# EAGLE design UH_007 (EAGLE 7.3.0)
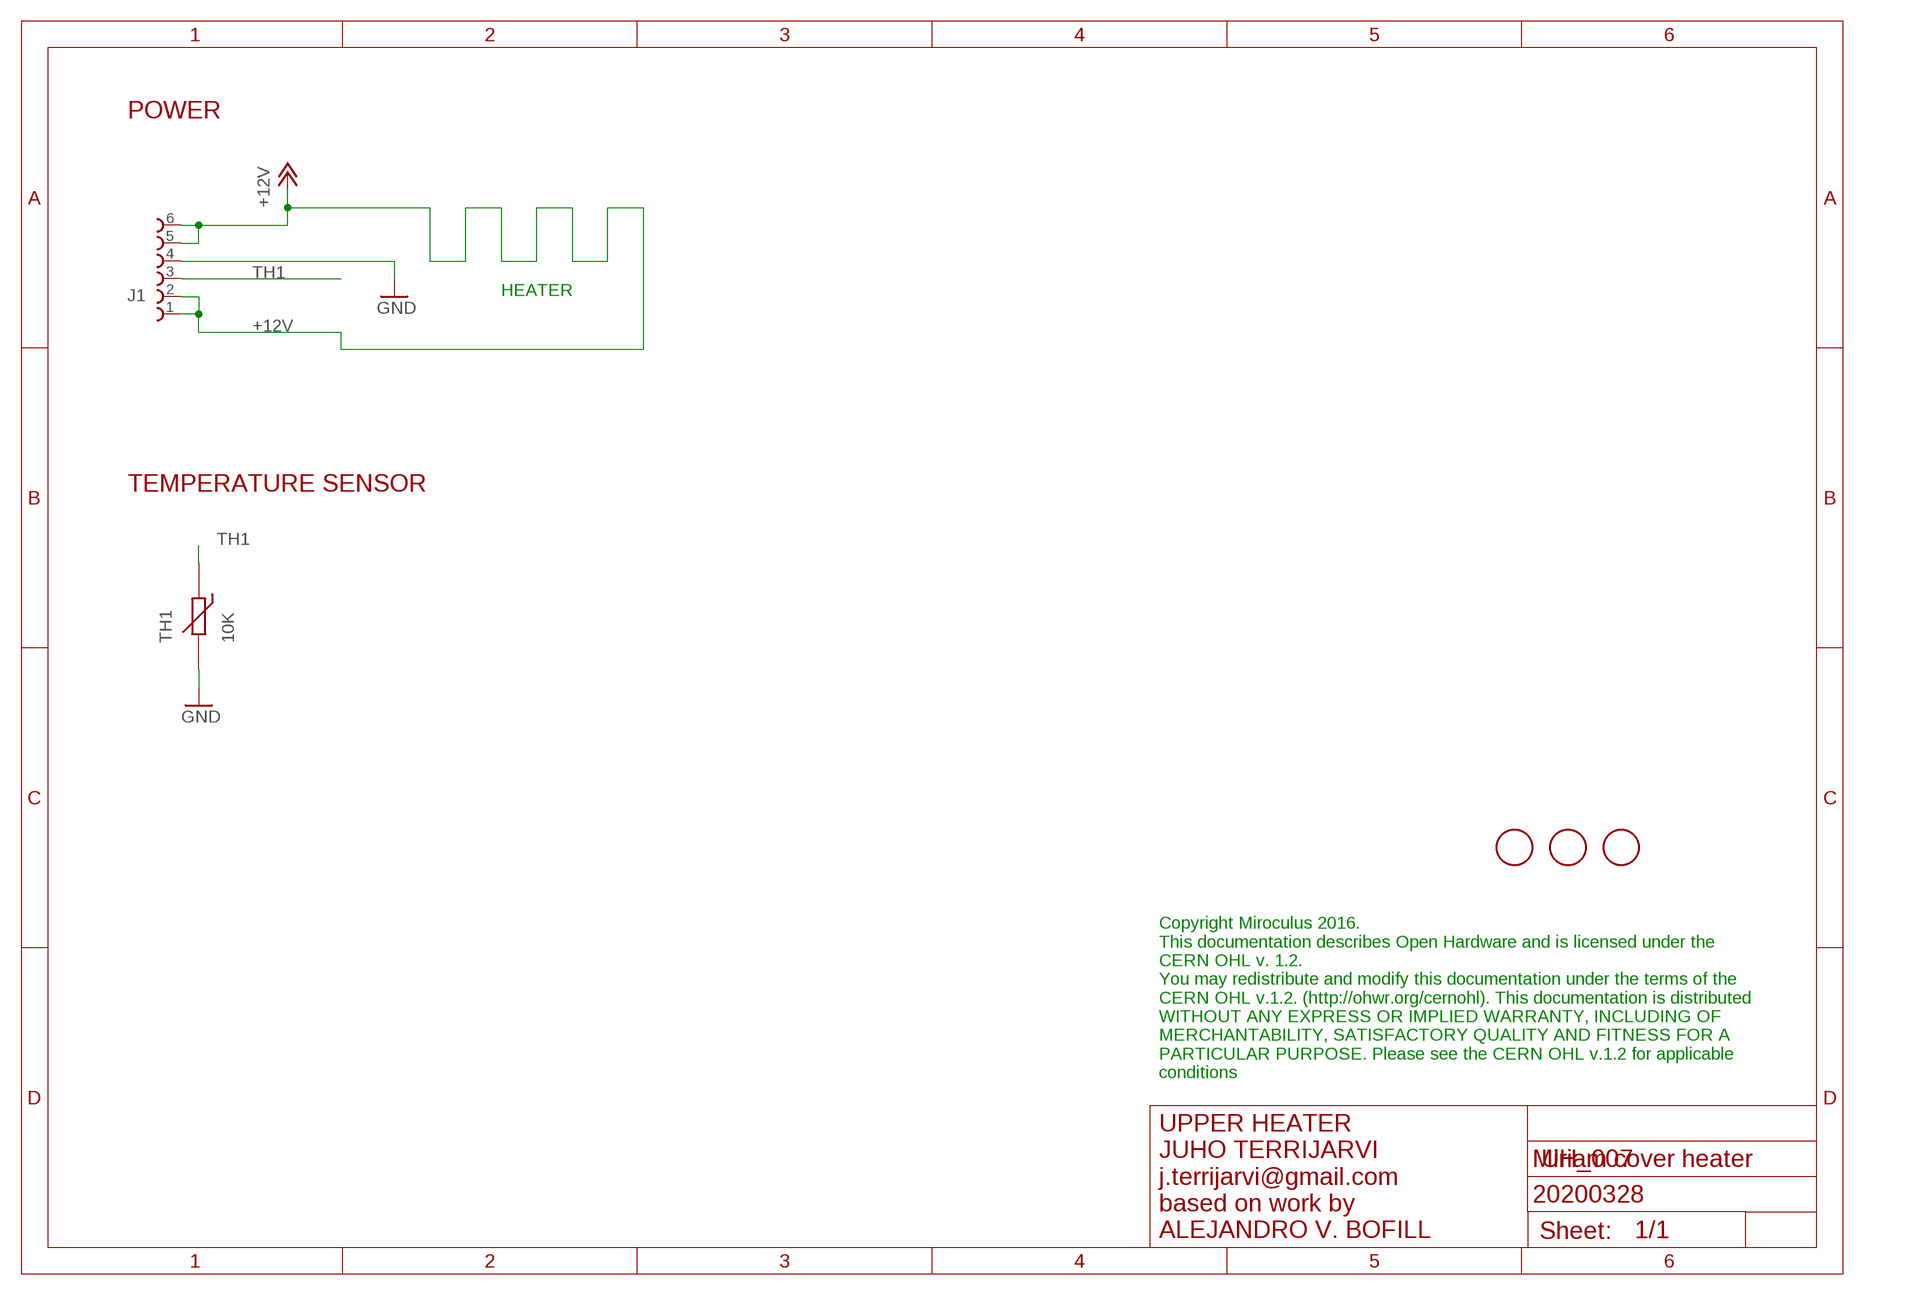
[diagram p0: schematic, sheet 1]

## Parts
FD1  FIDUCIALMOUNT  [FIDUCIA-MOUNT]
FD2  FIDUCIALMOUNT  [FIDUCIA-MOUNT]
FD3  FIDUCIALMOUNT  [FIDUCIA-MOUNT]
J1  68710614522  [68710614522]
TH1  10K  THERMISTOR_SMD_0603  [THERMISTOR_SMD_0603]

## Nets
+12V [power12]: J1.1 J1.2 J1.5 J1.6
GND: J1.4 TH1.2
TH1: J1.3 TH1.1

## Notes on the sheet
- POWER
- HEATER
- TEMPERATURE SENSOR
- Copyright Miroculus 2016.
  This documentation describes Open Hardware and is licensed under the
  CERN OHL v. 1.2.
  You may redistribute and modify this documentation under the terms of the
  CERN OHL v.1.2. (http://ohwr.org/cernohl). This documentation is distributed
  WITHOUT ANY EXPRESS OR IMPLIED WARRANTY, INCLUDING OF
  MERCHANTABILITY, SATISFACTORY QUALITY AND FITNESS FOR A
  PARTICULAR PURPOSE. Please see the CERN OHL v.1.2 for applicable
  conditions
- UPPER HEATER
  JUHO TERRIJARVI
  j.terrijarvi@gmail.com
  based on work by
  ALEJANDRO V. BOFILL
- Miriam cover heater
- 20200328

## Library data of the parts
FD1-FD3 = SmartPrj:FIDUCIALMOUNT
J1 = Eagle_FPC_CONNECTOR_AND_FFC_CAB (rev18c):68710614522: WE-FPC 0.5mm SMT ZIF Horizontal Bottom Contact, 6 Pins=>Code : Con_FPC_ZIF_0.50_68710614522 <http://katalog.we-online.de/media/images/eican/Con_FPC_ZIF_0.50_6871xx14522_pf2.jpg> Details see: http://katalog.we-online.de/en/em/687_1xx_145_22 Created 2014-07-09, Karrer Zheng 2014 (C) Würth Elektronik
TH1 = Miroculus:THERMISTOR_SMD_0603

## Net classes
0 default: width 0.254 mm, drill 0.406 mm, clearance 0.178 mm
1 power: width 0.406 mm, drill 0.813 mm, clearance 0.406 mm
2 gnd: width 0.254 mm, drill 0.406 mm, clearance 0.178 mm
3 power usb: width 0.305 mm, drill 0.406 mm, clearance 0.254 mm
4 power12: width 1.778 mm, drill 0.889 mm, clearance 0.406 mm

## Board
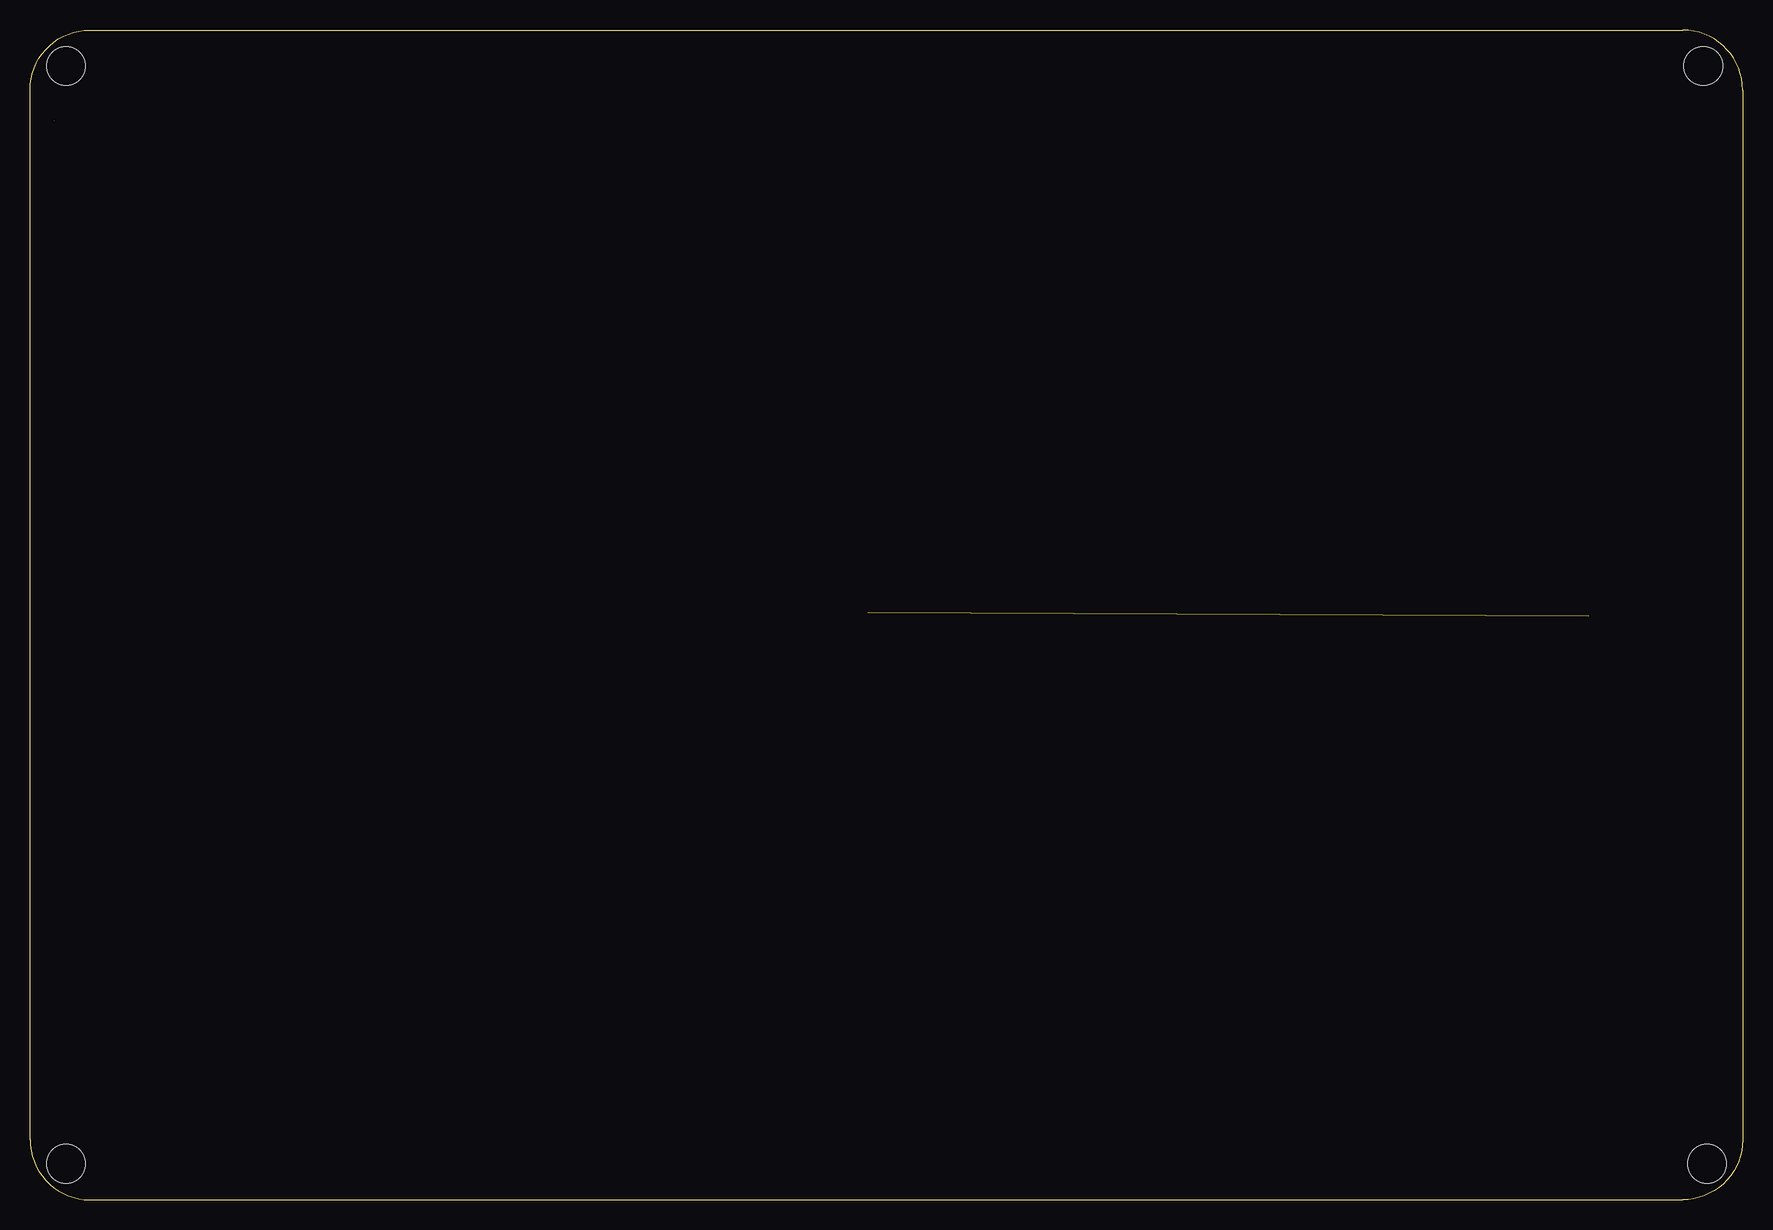
[diagram p1: board, top side]
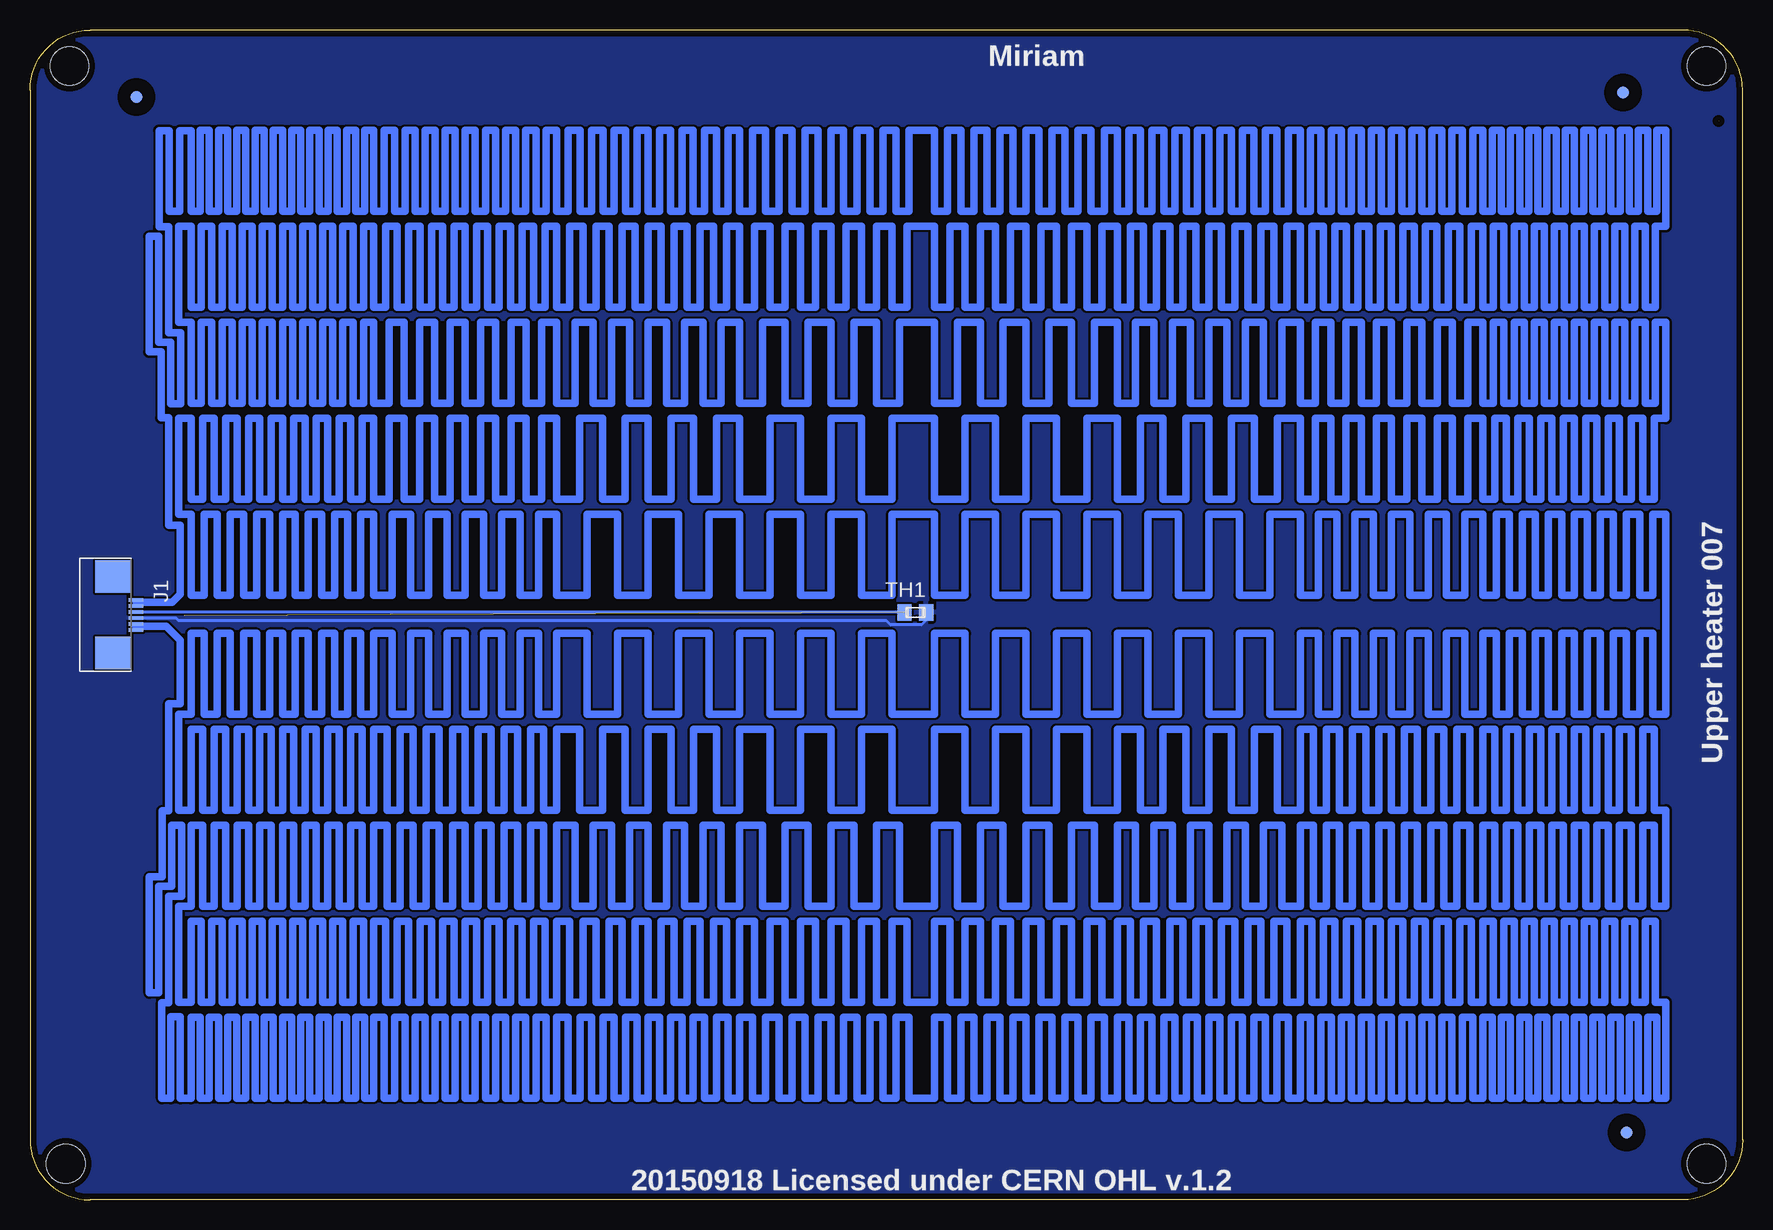
[diagram p2: board, bottom side, seen from below]

Size 142.76 x 97.48 mm. Coordinates in mm from the lower left corner, seen from the top.
Outline: 2.01,89.92 arc0 2.01,89.92
Outline: 0,5 arc90 5,0 137.76,0 arc90 142.76,5 142.76,92.48 arc90 137.76,97.48 5,97.48 arc90 0,92.48 0,5
Copper layers (1*16): Top 0.0178mm / dielectric 59mil / Bottom 0.0178mm
Design rules "SSC-EAGLE-2Lyr_v1.0.0.3": minimum track width 6mil, minimum drill 14mil, track to track 6mil, track to pad 6mil, pad to pad 6mil, via to via 6mil, smd to smd 6mil, copper to edge 20mil, drill to drill 16mil, minimum pad ring 8mil, minimum via ring 8mil, stop-mask expansion 3mil, vias tented up to drill 0mil, thermal gap 10mil
Holes 3.2 mm at 3,94.48 139.48,94.48 139.78,3 3,3

### Footprints (pad centres in the part's own frame; a part is rotated, then mirrored left to right if it is on the bottom)
FIDUCIA-MOUNT = smd 1.016 x 1.016: P$1 0,0
68710614522 = smd 0.3 x 1.2: 1 -1.25,1.9; 2 -0.75,1.9; 3 -0.25,1.9; 4 0.25,1.9; 5 0.75,1.9; 6 1.25,1.9 | smd 2.7 x 3: Z1 -3.18,0; Z2 3.18,0
THERMISTOR_SMD_0603 = smd 1.181 x 1.378: 1 -0.9,0; 2 0.9,0

### Placement (x,y rotation side)
FD1  9.67,5.62 0 bottom
FD2  9.96,92.29 0 bottom
FD3  133.89,91.91 0 bottom
J1  135.81,48.74 270 bottom
TH1  68.96,48.95 0 bottom

### Tracks (layer width: path | path; a pad name or v marks a point on that pad's centre or on a via)
+12V
  Bottom 0.254: J1.1 J1.2 133.91,49.78 | J1.6 J1.5 133.91,47.82 133.96,47.78
  Bottom 0.635: 133.91,49.78 130.91,49.78 130.25,50.44 130.25,56.21 131.19,56.21 131.19,65.15 131.83,65.15 131.83,70.66 132.84,70.66 132.84,80.29 132.03,80.29 132.03,71.45 131.04,71.45 131.04,66.32 130.2,66.32 130.2,72.26 131.19,72.26 131.19,81.1 132,81.1 132,89.1 131.17,89.1 131.17,82.37 130.28,82.37 130.28,89.1 129.34,89.1 129.34,82.39 128.57,82.39 128.57,89.12 127.81,89.12 127.81,82.39 127.05,82.39 127.05,89.12 126.29,89.12 126.29,82.39 125.53,82.39 125.53,89.12 124.77,89.12 124.77,82.39 124,82.39 124,89.12 123.24,89.12 123.24,82.39 122.48,82.39 122.48,89.12 121.72,89.12 121.72,82.39 120.95,82.39 120.95,89.12 120.19,89.12 120.19,82.39 119.43,82.39 119.43,89.12 118.67,89.12 118.67,82.39 117.91,82.39 117.91,89.12 117.14,89.12 117.14,82.39 116.38,82.39 116.38,89.12 115.62,89.12 115.62,82.39 114.86,82.39 114.86,89.12 114.1,89.12 114.1,82.39 113.23,82.39 113.23,89.12 112.37,89.12 112.37,82.39 111.51,82.39 111.51,89.12 110.67,89.12 110.67,82.39 109.83,82.39 109.83,89.12 108.99,89.12 108.99,82.39 108.15,82.39 108.15,89.12 107.31,89.12 107.31,82.39 106.48,82.39 106.48,89.12 105.64,89.12 105.64,82.39 104.8,82.39 104.8,89.12 103.96,89.12 103.96,82.39 103.12,82.39 103.12,89.12 102.29,89.12 102.29,82.39 101.45,82.39 101.45,89.12 100.58,89.12 100.58,82.39 99.72,82.39 99.72,89.12 98.86,89.12 98.86,82.39 97.89,82.39 97.89,89.12 96.93,89.12 96.93,82.39 95.96,82.39 95.96,89.12 95,89.12 95,82.39 94.06,82.39 94.06,89.12 93.12,89.12 93.12,82.39 92.18,82.39 92.18,89.12 91.24,89.12 91.24,82.39 90.3,82.39 90.3,89.12 89.36,89.12 89.36,82.39 88.42,82.39 88.42,89.12 87.48,89.12 87.48,82.39 86.51,82.39 86.51,89.12 85.55,89.12 85.55,82.39 84.58,82.39 84.58,89.12 83.62,89.12 83.62,82.39 82.53,82.39 82.53,89.12 81.43,89.12 81.43,82.39 80.34,82.39 80.34,89.12 79.25,89.12 79.25,82.39 78.16,82.39 78.16,89.12 77.06,89.12 77.06,82.39 76,82.39 76,89.12 74.93,89.12 74.93,82.39 73.84,82.39 73.84,89.12 72.75,89.12 72.75,82.39 71.65,82.39 71.65,89.12 70.56,89.12 70.56,82.39 69.47,82.39 69.47,89.12 67.36,89.12 67.36,82.39 66.27,82.39 66.27,89.12 65.18,89.12 65.18,82.39 64.08,82.39 64.08,89.12 62.99,89.12 62.99,82.39 61.9,82.39 61.9,89.12 60.81,89.12 60.81,82.39 59.74,82.39 59.74,89.12 58.67,89.12 58.67,82.39 57.58,82.39 57.58,89.12 56.49,89.12 56.49,82.39 55.4,82.39 55.4,89.12 54.3,89.12 54.3,82.39 53.21,82.39 53.21,89.12 52.12,89.12 52.12,82.39 51.16,82.39 51.16,89.12 50.19,89.12 50.19,82.39 49.23,82.39 49.23,89.12 48.26,89.12 48.26,82.39 47.32,82.39 47.32,89.12 46.38,89.12 46.38,82.39 45.44,82.39 45.44,89.12 44.5,89.12 44.5,82.39 43.56,82.39 43.56,89.12 42.62,89.12 42.62,82.39 41.68,82.39 41.68,89.12 40.74,89.12 40.74,82.39 39.78,82.39 39.78,89.12 38.81,89.12 38.81,82.39 37.85,82.39 37.85,89.12 36.88,89.12 36.88,82.39 36.02,82.39 36.02,89.12 35.15,89.12 35.15,82.39 34.29,82.39 34.29,89.12 33.45,89.12 33.45,82.39 32.61,82.39 32.61,89.12 31.77,89.12 31.77,82.39 30.94,82.39 30.94,89.12 30.1,89.12 30.1,82.39 29.26,82.39 29.26,89.12 28.42,89.12 28.42,82.39 27.58,82.39 27.58,89.12 26.75,89.12 26.75,82.39 25.91,82.39 25.91,89.12 25.07,89.12 25.07,82.39 24.23,82.39 24.23,89.12 23.37,89.12 23.37,82.39 22.5,82.39 22.5,89.12 21.64,89.12 21.64,82.39 20.88,82.39 20.88,89.12 20.12,89.12 20.12,82.39 19.36,82.39 19.36,89.12 18.59,89.12 18.59,82.39 17.83,82.39 17.83,89.12 17.07,89.12 17.07,82.39 16.31,82.39 16.31,89.12 15.54,89.12 15.54,82.39 14.78,82.39 14.78,89.12 14.02,89.12 14.02,82.39 13.26,82.39 13.26,89.12 12.5,89.12 12.5,82.39 11.73,82.39 11.73,89.12 10.97,89.12 10.97,82.39 10.21,82.39 10.21,89.12 9.45,89.12 9.45,82.39 8.69,82.39 8.69,89.12 7.92,89.12 7.92,82.39 7.16,82.39 7.16,89.12 6.4,89.12 6.4,81.11 7.26,81.11 7.26,74.38 8.13,74.38 8.13,81.11 8.99,81.11 8.99,74.38 9.83,74.38 9.83,81.11 10.67,81.11 10.67,74.38 11.51,74.38 11.51,81.11 12.34,81.11 12.34,74.38 13.18,74.38 13.18,81.11 14.02,81.11 14.02,74.38 14.86,74.38 14.86,81.11 15.7,81.11 15.7,74.38 16.54,74.38 16.54,81.11 17.37,81.11 17.37,74.38 18.21,74.38 18.21,81.11 19.05,81.11 19.05,74.38 19.91,74.38 19.91,81.11 20.78,81.11 20.78,74.38 21.64,74.38 21.64,81.11 22.61,81.11 22.61,74.38 23.57,74.38 23.57,81.11 24.54,81.11 24.54,74.38 25.5,74.38 25.5,81.11 26.44,81.11 26.44,74.38 27.38,74.38 27.38,81.11 28.32,81.11 28.32,74.38 29.26,74.38 29.26,81.11 30.2,81.11 30.2,74.38 31.14,74.38 31.14,81.11 32.08,81.11 32.08,74.38 33.02,74.38 33.02,81.11 33.98,81.11 33.98,74.38 34.95,74.38 34.95,81.11 35.92,81.11 35.92,74.38 36.88,74.38 36.88,81.11 37.97,81.11 37.97,74.38 39.06,74.38 39.06,81.11 40.16,81.11 40.16,74.38 41.25,74.38 41.25,81.11 42.34,81.11 42.34,74.38 43.43,74.38 43.43,81.11 44.5,81.11 44.5,74.38 45.57,74.38 45.57,81.11 46.66,81.11 46.66,74.38 47.75,74.38 47.75,81.11 48.84,81.11 48.84,74.38 49.94,74.38 49.94,81.11 51.03,81.11 51.03,74.38 52.12,74.38 52.12,81.11 53.39,81.11 53.39,74.38 54.66,74.38 54.66,81.11 55.93,81.11 55.93,74.38 57.2,74.38 57.2,81.11 58.47,81.11 58.47,74.38 59.74,74.38 59.74,81.11 61.01,81.11 61.01,74.38 62.28,74.38 62.28,81.11 63.55,81.11 63.55,74.38 64.82,74.38 64.82,81.11 66.09,81.11 66.09,74.38 67.36,74.38 67.36,81.11 69.65,81.11 69.65,74.38 70.92,74.38 70.92,81.11 72.19,81.11 72.19,74.38 73.46,74.38 73.46,81.11 74.73,81.11 74.73,74.38 76,74.38 76,81.11 77.27,81.11 77.27,74.38 78.54,74.38 78.54,81.11 79.81,81.11 79.81,74.38 81.08,74.38 81.08,81.11 82.35,81.11 82.35,74.38 83.62,74.38 83.62,81.11 84.71,81.11 84.71,74.38 85.8,74.38 85.8,81.11 86.89,81.11 86.89,74.38 87.99,74.38 87.99,81.11 89.08,81.11 89.08,74.38 90.17,74.38 90.17,81.11 91.24,81.11 91.24,74.38 92.3,74.38 92.3,81.11 93.4,81.11 93.4,74.38 94.49,74.38 94.49,81.11 95.58,81.11 95.58,74.38 96.67,74.38 96.67,81.11 97.77,81.11 97.77,74.38 98.86,74.38 98.86,81.11 99.82,81.11 99.82,74.38 100.79,74.38 100.79,81.11 101.75,81.11 101.75,74.38 102.72,74.38 102.72,81.11 103.66,81.11 103.66,74.38 104.6,74.38 104.6,81.11 105.54,81.11 105.54,74.38 106.48,74.38 106.48,81.11 107.42,81.11 107.42,74.38 108.36,74.38 108.36,81.11 109.3,81.11 109.3,74.38 110.24,74.38 110.24,81.11 111.2,81.11 111.2,74.38 112.17,74.38 112.17,81.11 113.13,81.11 113.13,74.38 114.1,74.38 114.1,81.11 114.96,81.11 114.96,74.38 115.82,74.38 115.82,81.11 116.69,81.11 116.69,74.38 117.53,74.38 117.53,81.11 118.36,81.11 118.36,74.38 119.2,74.38 119.2,81.11 120.04,81.11 120.04,74.38 120.88,74.38 120.88,81.11 121.72,81.11 121.72,74.38 122.56,74.38 122.56,81.11 123.39,81.11 123.39,74.38 124.23,74.38 124.23,81.11 125.07,81.11 125.07,74.38 125.91,74.38 125.91,81.11 126.75,81.11 126.75,74.38 127.61,74.38 127.61,81.11 128.47,81.11 128.47,74.38 129.34,74.38 129.34,81.11 130.35,81.11 130.35,73.11 129.34,73.11 129.34,66.38 128.47,66.38 128.47,73.11 127.61,73.11 127.61,66.38 126.75,66.38 126.75,73.11 125.91,73.11 125.91,66.38 125.07,66.38 125.07,73.11 124.23,73.11 124.23,66.38 123.39,66.38 123.39,73.11 122.56,73.11 122.56,66.38 121.72,66.38 121.72,73.11 120.88,73.11 120.88,66.38 120.04,66.38 120.04,73.11 119.2,73.11 119.2,66.38 118.36,66.38 118.36,73.11 117.53,73.11 117.53,66.38 116.69,66.38 116.69,73.11 115.82,73.11 115.82,66.38 114.96,66.38 114.96,73.11 114.1,73.11 114.1,66.38 112.83,66.38 112.83,73.11 111.56,73.11 111.56,66.38 110.29,66.38 110.29,73.11 109.02,73.11 109.02,66.38 107.75,66.38 107.75,73.11 106.48,73.11 106.48,66.38 105.21,66.38 105.21,73.11 103.94,73.11 103.94,66.38 102.67,66.38 102.67,73.11 101.4,73.11 101.4,66.38 100.13,66.38 100.13,73.11 98.86,73.11 98.86,66.38 97.33,66.38 97.33,73.11 95.81,73.11 95.81,66.38 94.28,66.38 94.28,73.11 92.76,73.11 92.76,66.38 91.24,66.38 91.24,73.11 89.71,73.11 89.71,66.38 88.19,66.38 88.19,73.11 86.67,73.11 86.67,66.38 85.14,66.38 85.14,73.11 83.62,73.11 83.62,66.38 81.71,66.38 81.71,73.11 79.81,73.11 79.81,66.38 77.9,66.38 77.9,73.11 76,73.11 76,66.38 74.09,66.38 74.09,73.11 72.19,73.11 72.19,66.38 70.28,66.38 70.28,73.11 67.36,73.11 67.36,66.38 65.46,66.38 65.46,73.11 63.55,73.11 63.55,66.38 61.65,66.38 61.65,73.11 59.74,73.11 59.74,66.38 57.84,66.38 57.84,73.11 55.93,73.11 55.93,66.38 54.03,66.38 54.03,73.11 52.12,73.11 52.12,66.38 50.6,66.38 50.6,73.11 49.07,73.11 49.07,66.38 47.55,66.38 47.55,73.11 46.02,73.11 46.02,66.38 44.5,66.38 44.5,73.11 42.98,73.11 42.98,66.38 41.45,66.38 41.45,73.11 39.93,73.11 39.93,66.38 38.41,66.38 38.41,73.11 36.88,73.11 36.88,66.38 35.61,66.38 35.61,73.11 34.34,73.11 34.34,66.38 33.07,66.38 33.07,73.11 31.8,73.11 31.8,66.38 30.53,66.38 30.53,73.11 29.26,73.11 29.26,66.38 27.99,66.38 27.99,73.11 26.72,73.11 26.72,66.38 25.45,66.38 25.45,73.11 24.18,73.11 24.18,66.38 22.91,66.38 22.91,73.11 21.64,73.11 21.64,66.38 20.78,66.38 20.78,73.11 19.91,73.11 19.91,66.38 19.05,66.38 19.05,73.11 18.21,73.11 18.21,66.38 17.37,66.38 17.37,73.11 16.54,73.11 16.54,66.38 15.7,66.38 15.7,73.11 14.86,73.11 14.86,66.38 14.02,66.38 14.02,73.11 13.18,73.11 13.18,66.38 12.34,66.38 12.34,73.11 11.51,73.11 11.51,66.38 10.67,66.38 10.67,73.11 9.83,73.11 9.83,66.38 8.99,66.38 8.99,73.11 8.13,73.11 8.13,66.38 7.26,66.38 7.26,73.11 6.4,73.11 6.4,65.11 7.37,65.11 7.37,58.38 8.33,58.38 8.33,65.11 9.3,65.11 9.3,58.38 10.26,58.38 10.26,65.11 11.2,65.11 11.2,58.38 12.14,58.38 12.14,65.11 13.08,65.11 13.08,58.38 14.02,58.38 14.02,65.11 14.96,65.11 14.96,58.38 15.9,58.38 15.9,65.11 16.84,65.11 16.84,58.38 17.78,58.38 17.78,65.11 18.75,65.11 18.75,58.38 19.71,58.38 19.71,65.11 20.68,65.11 20.68,58.38 21.64,58.38 21.64,65.11 22.91,65.11 22.91,58.38 24.18,58.38 24.18,65.11 25.45,65.11 25.45,58.38 26.72,58.38 26.72,65.11 27.99,65.11 27.99,58.38 29.26,58.38 29.26,65.11 30.53,65.11 30.53,58.38 31.8,58.38 31.8,65.11 33.07,65.11 33.07,58.38 34.34,58.38 34.34,65.11 35.61,65.11 35.61,58.38 36.88,58.38 36.88,65.11 38.79,65.11 38.79,58.38 40.69,58.38 40.69,65.11 42.6,65.11 42.6,58.38 44.5,58.38 44.5,65.11 46.41,65.11 46.41,58.38 48.31,58.38 48.31,65.11 50.22,65.11 50.22,58.38 52.12,58.38 52.12,65.11 54.66,65.11 54.66,58.38 57.2,58.38 57.2,65.11 59.74,65.11 59.74,58.38 62.28,58.38 62.28,65.11 64.82,65.11 64.82,58.38 67.36,58.38 67.36,65.11 70.92,65.11 70.92,58.38 73.46,58.38 73.46,65.11 76,65.11 76,58.38 78.54,58.38 78.54,65.11 81.08,65.11 81.08,58.38 83.62,58.38 83.62,65.11 85.52,65.11 85.52,58.38 87.43,58.38 87.43,65.11 89.33,65.11 89.33,58.38 91.24,58.38 91.24,65.11 93.14,65.11 93.14,58.38 95.05,58.38 95.05,65.11 96.95,65.11 96.95,58.38 98.86,58.38 98.86,65.11 100.13,65.11 100.13,58.38 101.4,58.38 101.4,65.11 102.67,65.11 102.67,58.38 103.94,58.38 103.94,65.11 105.21,65.11 105.21,58.38 106.48,58.38 106.48,65.11 107.75,65.11 107.75,58.38 109.02,58.38 109.02,65.11 110.29,65.11 110.29,58.38 111.56,58.38 111.56,65.11 112.83,65.11 112.83,58.38 114.1,58.38 114.1,65.11 115.06,65.11 115.06,58.38 116.03,58.38 116.03,65.11 116.99,65.11 116.99,58.38 117.96,58.38 117.96,65.11 118.9,65.11 118.9,58.38 119.84,58.38 119.84,65.11 120.78,65.11 120.78,58.38 121.72,58.38 121.72,65.11 122.66,65.11 122.66,58.38 123.6,58.38 123.6,65.11 124.54,65.11 124.54,58.38 125.48,58.38 125.48,65.11 126.44,65.11 126.44,58.38 127.41,58.38 127.41,65.11 128.37,65.11 128.37,58.38 129.34,58.38 129.34,65.11 130.35,65.11 130.35,57.11 129.34,57.11 129.34,50.38 128.25,50.38 128.25,57.11 127.15,57.11 127.15,50.38 126.06,50.38 126.06,57.11 124.97,57.11 124.97,50.38 123.88,50.38 123.88,57.11 122.78,57.11 122.78,50.38 121.72,50.38 121.72,57.11 120.65,57.11 120.65,50.38 119.56,50.38 119.56,57.11 118.47,57.11 118.47,50.38 117.37,50.38 117.37,57.11 116.28,57.11 116.28,50.38 115.19,50.38 115.19,57.11 114.1,57.11 114.1,50.38 112.57,50.38 112.57,57.11 111.05,57.11 111.05,50.38 109.53,50.38 109.53,57.11 108,57.11 108,50.38 106.48,50.38 106.48,57.11 104.95,57.11 104.95,50.38 103.43,50.38 103.43,57.11 101.91,57.11 101.91,50.38 100.38,50.38 100.38,57.11 98.86,57.11 98.86,50.38 96.32,50.38 96.32,57.11 93.78,57.11 93.78,50.38 91.24,50.38 91.24,57.11 88.7,57.11 88.7,50.38 86.16,50.38 86.16,57.11 83.62,57.11 83.62,50.38 81.08,50.38 81.08,57.11 78.54,57.11 78.54,50.38 76,50.38 76,57.11 73.46,57.11 73.46,50.38 70.92,50.38 70.92,57.11 67.36,57.11 67.36,50.38 64.82,50.38 64.82,57.11 62.28,57.11 62.28,50.38 59.74,50.38 59.74,57.11 57.2,57.11 57.2,50.38 54.66,50.38 54.66,57.11 52.12,57.11 52.12,50.38 49.58,50.38 49.58,57.11 47.04,57.11 47.04,50.38 44.5,50.38 44.5,57.11 41.96,57.11 41.96,50.38 39.42,50.38 39.42,57.11 36.88,57.11 36.88,50.38 35.36,50.38 35.36,57.11 33.83,57.11 33.83,50.38 32.31,50.38 32.31,57.11 30.79,57.11 30.79,50.38 29.26,50.38 29.26,57.11 27.74,57.11 27.74,50.38 26.21,50.38 26.21,57.11 24.69,57.11 24.69,50.38 23.16,50.38 23.16,57.11 21.64,57.11 21.64,50.38 20.55,50.38 20.55,57.11 19.46,57.11 19.46,50.38 18.36,50.38 18.36,57.11 17.27,57.11 17.27,50.38 16.18,50.38 16.18,57.11 15.09,57.11 15.09,50.38 14.02,50.38 14.02,57.11 12.95,57.11 12.95,50.38 11.86,50.38 11.86,57.11 10.77,57.11 10.77,50.38 9.68,50.38 9.68,57.11 8.59,57.11 8.59,50.38 7.49,50.38 7.49,57.11 6.4,57.11 6.4,40.48 7.49,40.48 7.49,47.21 8.59,47.21 8.59,40.48 9.68,40.48 9.68,47.21 10.77,47.21 10.77,40.48 11.86,40.48 11.86,47.21 12.95,47.21 12.95,40.48 14.02,40.48 14.02,47.21 15.09,47.21 15.09,40.48 16.18,40.48 16.18,47.21 17.27,47.21 17.27,40.48 18.36,40.48 18.36,47.21 19.46,47.21 19.46,40.48 20.55,40.48 20.55,47.21 21.64,47.21 21.64,40.48 23.16,40.48 23.16,47.21 24.69,47.21 24.69,40.48 26.21,40.48 26.21,47.21 27.74,47.21 27.74,40.48 29.26,40.48 29.26,47.21 30.79,47.21 30.79,40.48 32.31,40.48 32.31,47.21 33.83,47.21 33.83,40.48 35.36,40.48 35.36,47.21 36.88,47.21 36.88,40.48 39.42,40.48 39.42,47.21 41.96,47.21 41.96,40.48 44.5,40.48 44.5,47.21 47.04,47.21 47.04,40.48 49.58,40.48 49.58,47.21 52.12,47.21 52.12,40.48 54.66,40.48 54.66,47.21 57.2,47.21 57.2,40.48 59.74,40.48 59.74,47.21 62.28,47.21 62.28,40.48 64.82,40.48 64.82,47.21 67.36,47.21 67.36,40.48 70.92,40.48 70.92,47.21 73.46,47.21 73.46,40.48 76,40.48 76,47.21 78.54,47.21 78.54,40.48 81.08,40.48 81.08,47.21 83.62,47.21 83.62,40.48 86.16,40.48 86.16,47.21 88.7,47.21 88.7,40.48 91.24,40.48 91.24,47.21 93.78,47.21 93.78,40.48 96.32,40.48 96.32,47.21 98.86,47.21 98.86,40.48 100.38,40.48 100.38,47.21 101.91,47.21 101.91,40.48 103.43,40.48 103.43,47.21 104.95,47.21 104.95,40.48 106.48,40.48 106.48,47.21 108,47.21 108,40.48 109.53,40.48 109.53,47.21 111.05,47.21 111.05,40.48 112.57,40.48 112.57,47.21 114.1,47.21 114.1,40.48 115.19,40.48 115.19,47.21 116.28,47.21 116.28,40.48 117.37,40.48 117.37,47.21 118.47,47.21 118.47,40.48 119.56,40.48 119.56,47.21 120.65,47.21 120.65,40.48 121.72,40.48 121.72,47.21 122.78,47.21 122.78,40.48 123.88,40.48 123.88,47.21 124.97,47.21 124.97,40.48 126.06,40.48 126.06,47.21 127.15,47.21 127.15,40.48 128.25,40.48 128.25,47.21 129.34,47.21 129.34,40.48 130.35,40.48 130.35,32.47 129.34,32.47 129.34,39.2 128.37,39.2 128.37,32.47 127.41,32.47 127.41,39.2 126.44,39.2 126.44,32.47 125.48,32.47 125.48,39.2 124.54,39.2 124.54,32.47 123.6,32.47 123.6,39.2 122.66,39.2 122.66,32.47 121.72,32.47 121.72,39.2 120.78,39.2 120.78,32.47 119.84,32.47 119.84,39.2 118.9,39.2 118.9,32.47 117.96,32.47 117.96,39.2 116.99,39.2 116.99,32.47 116.03,32.47 116.03,39.2 115.06,39.2 115.06,32.47 114.1,32.47 114.1,39.2 113,39.2 113,32.47 111.91,32.47 111.91,39.2 110.82,39.2 110.82,32.47 109.73,32.47 109.73,39.2 108.64,39.2 108.64,32.47 107.54,32.47 107.54,39.2 106.48,39.2 106.48,32.47 105.41,32.47 105.41,39.2 104.32,39.2 104.32,32.47 103.23,32.47 103.23,39.2 102.13,39.2 102.13,32.47 101.04,32.47 101.04,39.2 99.95,39.2 99.95,32.47 98.86,32.47 98.86,39.2 96.95,39.2 96.95,32.47 95.05,32.47 95.05,39.2 93.14,39.2 93.14,32.47 91.24,32.47 91.24,39.2 89.33,39.2 89.33,32.47 87.43,32.47 87.43,39.2 85.52,39.2 85.52,32.47 83.62,32.47 83.62,39.2 81.08,39.2 81.08,32.47 78.54,32.47 78.54,39.2 76,39.2 76,32.47 73.46,32.47 73.46,39.2 70.92,39.2 70.92,32.47 67.36,32.47 67.36,39.2 64.82,39.2 64.82,32.47 62.28,32.47 62.28,39.2 59.74,39.2 59.74,32.47 57.2,32.47 57.2,39.2 54.66,39.2 54.66,32.47 52.12,32.47 52.12,39.2 50.22,39.2 50.22,32.47 48.31,32.47 48.31,39.2 46.41,39.2 46.41,32.47 44.5,32.47 44.5,39.2 42.6,39.2 42.6,32.47 40.69,32.47 40.69,39.2 38.79,39.2 38.79,32.47 36.88,32.47 36.88,39.2 35.79,39.2 35.79,32.47 34.7,32.47 34.7,39.2 33.6,39.2 33.6,32.47 32.51,32.47 32.51,39.2 31.42,39.2 31.42,32.47 30.33,32.47 30.33,39.2 29.26,39.2 29.26,32.47 28.19,32.47 28.19,39.2 27.1,39.2 27.1,32.47 26.01,32.47 26.01,39.2 24.92,39.2 24.92,32.47 23.82,32.47 23.82,39.2 22.73,39.2 22.73,32.47 21.64,32.47 21.64,39.2 20.68,39.2 20.68,32.47 19.71,32.47 19.71,39.2 18.75,39.2 18.75,32.47 17.78,32.47 17.78,39.2 16.84,39.2 16.84,32.47 15.9,32.47 15.9,39.2 14.96,39.2 14.96,32.47 14.02,32.47 14.02,39.2 13.08,39.2 13.08,32.47 12.14,32.47 12.14,39.2 11.2,39.2 11.2,32.47 10.26,32.47 10.26,39.2 9.3,39.2 9.3,32.47 8.33,32.47 8.33,39.2 7.37,39.2 7.37,32.47 6.4,32.47 6.4,24.47 7.37,24.47 7.37,31.2 8.33,31.2 8.33,24.47 9.3,24.47 9.3,31.2 10.26,31.2 10.26,24.47 11.2,24.47 11.2,31.2 12.14,31.2 12.14,24.47 13.08,24.47 13.08,31.2 14.02,31.2 14.02,24.47 14.96,24.47 14.96,31.2 15.9,31.2 15.9,24.47 16.84,24.47 16.84,31.2 17.78,31.2 17.78,24.47 18.75,24.47 18.75,31.2 19.71,31.2 19.71,24.47 20.68,24.47 20.68,31.2 21.64,31.2 21.64,24.47 22.73,24.47 22.73,31.2 23.82,31.2 23.82,24.47 24.92,24.47 24.92,31.2 26.01,31.2 26.01,24.47 27.1,24.47 27.1,31.2 28.19,31.2 28.19,24.47 29.26,24.47 29.26,31.2 30.33,31.2 30.33,24.47 31.42,24.47 31.42,31.2 32.51,31.2 32.51,24.47 33.6,24.47 33.6,31.2 34.7,31.2 34.7,24.47 35.79,24.47 35.79,31.2 36.88,31.2 36.88,24.47 38.41,24.47 38.41,31.2 39.93,31.2 39.93,24.47 41.45,24.47 41.45,31.2 42.98,31.2 42.98,24.47 44.5,24.47 44.5,31.2 46.02,31.2 46.02,24.47 47.55,24.47 47.55,31.2 49.07,31.2 49.07,24.47 50.6,24.47 50.6,31.2 52.12,31.2 52.12,24.47 54.03,24.47 54.03,31.2 55.93,31.2 55.93,24.47 57.84,24.47 57.84,31.2 59.74,31.2 59.74,24.47 61.65,24.47 61.65,31.2 63.55,31.2 63.55,24.47 65.46,24.47 65.46,31.2 67.36,31.2 67.36,24.47 70.28,24.47 70.28,31.2 72.19,31.2 72.19,24.47 74.09,24.47 74.09,31.2 76,31.2 76,24.47 77.9,24.47 77.9,31.2 79.81,31.2 79.81,24.47 81.71,24.47 81.71,31.2 83.62,31.2 83.62,24.47 85.14,24.47 85.14,31.2 86.67,31.2 86.67,24.47 88.19,24.47 88.19,31.2 89.71,31.2 89.71,24.47 91.24,24.47 91.24,31.2 92.76,31.2 92.76,24.47 94.28,24.47 94.28,31.2 95.81,31.2 95.81,24.47 97.33,24.47 97.33,31.2 98.86,31.2 98.86,24.47 99.95,24.47 99.95,31.2 101.04,31.2 101.04,24.47 102.13,24.47 102.13,31.2 103.23,31.2 103.23,24.47 104.32,24.47 104.32,31.2 105.41,31.2 105.41,24.47 106.48,24.47 106.48,31.2 107.54,31.2 107.54,24.47 108.64,24.47 108.64,31.2 109.73,31.2 109.73,24.47 110.82,24.47 110.82,31.2 111.91,31.2 111.91,24.47 113,24.47 113,31.2 114.1,31.2 114.1,24.47 115.06,24.47 115.06,31.2 116.03,31.2 116.03,24.47 116.99,24.47 116.99,31.2 117.96,31.2 117.96,24.47 118.9,24.47 118.9,31.2 119.84,31.2 119.84,24.47 120.78,24.47 120.78,31.2 121.72,31.2 121.72,24.47 122.66,24.47 122.66,31.2 123.6,31.2 123.6,24.47 124.54,24.47 124.54,31.2 125.48,31.2 125.48,24.47 126.44,24.47 126.44,31.2 127.41,31.2 127.41,24.47 128.37,24.47 128.37,31.2 129.34,31.2 129.34,24.47 130.35,24.47 130.35,16.47 129.34,16.47 129.34,23.2 128.47,23.2 128.47,16.47 127.61,16.47 127.61,23.2 126.75,23.2 126.75,16.47 125.91,16.47 125.91,23.2 125.07,23.2 125.07,16.47 124.23,16.47 124.23,23.2 123.39,23.2 123.39,16.47 122.56,16.47 122.56,23.2 121.72,23.2 121.72,16.47 120.88,16.47 120.88,23.2 120.04,23.2 120.04,16.47 119.2,16.47 119.2,23.2 118.36,23.2 118.36,16.47 117.53,16.47 117.53,23.2 116.69,23.2 116.69,16.47 115.82,16.47 115.82,23.2 114.96,23.2 114.96,16.47 114.1,16.47 114.1,23.2 113.13,23.2 113.13,16.47 112.17,16.47 112.17,23.2 111.2,23.2 111.2,16.47 110.24,16.47 110.24,23.2 109.3,23.2 109.3,16.47 108.36,16.47 108.36,23.2 107.42,23.2 107.42,16.47 106.48,16.47 106.48,23.2 105.54,23.2 105.54,16.47 104.6,16.47 104.6,23.2 103.66,23.2 103.66,16.47 102.72,16.47 102.72,23.2 101.75,23.2 101.75,16.47 100.79,16.47 100.79,23.2 99.82,23.2 99.82,16.47 98.86,16.47 98.86,23.2 97.77,23.2 97.77,16.47 96.67,16.47 96.67,23.2 95.58,23.2 95.58,16.47 94.49,16.47 94.49,23.2 93.4,23.2 93.4,16.47 92.3,16.47 92.3,23.2 91.24,23.2 91.24,16.47 90.17,16.47 90.17,23.2 89.08,23.2 89.08,16.47 87.99,16.47 87.99,23.2 86.89,23.2 86.89,16.47 85.8,16.47 85.8,23.2 84.71,23.2 84.71,16.47 83.62,16.47 83.62,23.2 82.35,23.2 82.35,16.47 81.08,16.47 81.08,23.2 79.81,23.2 79.81,16.47 78.54,16.47 78.54,23.2 77.27,23.2 77.27,16.47 76,16.47 76,23.2 74.73,23.2 74.73,16.47 73.46,16.47 73.46,23.2 72.19,23.2 72.19,16.47 70.92,16.47 70.92,23.2 69.65,23.2 69.65,16.47 67.36,16.47 67.36,23.2 66.09,23.2 66.09,16.47 64.82,16.47 64.82,23.2 63.55,23.2 63.55,16.47 62.28,16.47 62.28,23.2 61.01,23.2 61.01,16.47 59.74,16.47 59.74,23.2 58.47,23.2 58.47,16.47 57.2,16.47 57.2,23.2 55.93,23.2 55.93,16.47 54.66,16.47 54.66,23.2 53.39,23.2 53.39,16.47 52.12,16.47 52.12,23.2 51.03,23.2 51.03,16.47 49.94,16.47 49.94,23.2 48.84,23.2 48.84,16.47 47.75,16.47 47.75,23.2 46.66,23.2 46.66,16.47 45.57,16.47 45.57,23.2 44.5,23.2 44.5,16.47 43.43,16.47 43.43,23.2 42.34,23.2 42.34,16.47 41.25,16.47 41.25,23.2 40.16,23.2 40.16,16.47 39.06,16.47 39.06,23.2 37.97,23.2 37.97,16.47 36.88,16.47 36.88,23.2 35.92,23.2 35.92,16.47 34.95,16.47 34.95,23.2 33.98,23.2 33.98,16.47 33.02,16.47 33.02,23.2 32.08,23.2 32.08,16.47 31.14,16.47 31.14,23.2 30.2,23.2 30.2,16.47 29.26,16.47 29.26,23.2 28.32,23.2 28.32,16.47 27.38,16.47 27.38,23.2 26.44,23.2 26.44,16.47 25.5,16.47 25.5,23.2 24.54,23.2 24.54,16.47 23.57,16.47 23.57,23.2 22.61,23.2 22.61,16.47 21.64,16.47 21.64,23.2 20.78,23.2 20.78,16.47 19.91,16.47 19.91,23.2 19.05,23.2 19.05,16.47 18.21,16.47 18.21,23.2 17.37,23.2 17.37,16.47 16.54,16.47 16.54,23.2 15.7,23.2 15.7,16.47 14.86,16.47 14.86,23.2 14.02,23.2 14.02,16.47 13.18,16.47 13.18,23.2 12.34,23.2 12.34,16.47 11.51,16.47 11.51,23.2 10.67,23.2 10.67,16.47 9.83,16.47 9.83,23.2 8.99,23.2 8.99,16.47 8.13,16.47 8.13,23.2 7.26,23.2 7.26,16.47 6.4,16.47 6.4,8.47 7.16,8.47 7.16,15.2 7.92,15.2 7.92,8.47 8.69,8.47 8.69,15.2 9.45,15.2 9.45,8.47 10.21,8.47 10.21,15.2 10.97,15.2 10.97,8.47 11.73,8.47 11.73,15.2 12.5,15.2 12.5,8.47 13.26,8.47 13.26,15.2 14.02,15.2 14.02,8.47 14.78,8.47 14.78,15.2 15.54,15.2 15.54,8.47 16.31,8.47 16.31,15.2 17.07,15.2 17.07,8.47 17.83,8.47 17.83,15.2 18.59,15.2 18.59,8.47 19.36,8.47 19.36,15.2 20.12,15.2 20.12,8.47 20.88,8.47 20.88,15.2 21.64,15.2 21.64,8.47 22.5,8.47 22.5,15.2 23.37,15.2 23.37,8.47 24.23,8.47 24.23,15.2 25.07,15.2 25.07,8.47 25.91,8.47 25.91,15.2 26.75,15.2 26.75,8.47 27.58,8.47 27.58,15.2 28.42,15.2 28.42,8.47 29.26,8.47 29.26,15.2 30.1,15.2 30.1,8.47 30.94,8.47 30.94,15.2 31.77,15.2 31.77,8.47 32.61,8.47 32.61,15.2 33.45,15.2 33.45,8.47 34.29,8.47 34.29,15.2 35.15,15.2 35.15,8.47 36.02,8.47 36.02,15.2 36.88,15.2 36.88,8.47 37.85,8.47 37.85,15.2 38.81,15.2 38.81,8.47 39.78,8.47 39.78,15.2 40.74,15.2 40.74,8.47 41.68,8.47 41.68,15.2 42.62,15.2 42.62,8.47 43.56,8.47 43.56,15.2 44.5,15.2 44.5,8.47 45.44,8.47 45.44,15.2 46.38,15.2 46.38,8.47 47.32,8.47 47.32,15.2 48.26,15.2 48.26,8.47 49.23,8.47 49.23,15.2 50.19,15.2 50.19,8.47 51.16,8.47 51.16,15.2 52.12,15.2 52.12,8.47 53.21,8.47 53.21,15.2 54.3,15.2 54.3,8.47 55.4,8.47 55.4,15.2 56.49,15.2 56.49,8.47 57.58,8.47 57.58,15.2 58.67,15.2 58.67,8.47 59.74,8.47 59.74,15.2 60.81,15.2 60.81,8.47 61.9,8.47 61.9,15.2 62.99,15.2 62.99,8.47 64.08,8.47 64.08,15.2 65.18,15.2 65.18,8.47 66.27,8.47 66.27,15.2 67.36,15.2 67.36,8.47 69.47,8.47 69.47,15.2 70.56,15.2 70.56,8.47 71.65,8.47 71.65,15.2 72.75,15.2 72.75,8.47 73.84,8.47 73.84,15.2 74.93,15.2 74.93,8.47 76,8.47 76,15.2 77.06,15.2 77.06,8.47 78.16,8.47 78.16,15.2 79.25,15.2 79.25,8.47 80.34,8.47 80.34,15.2 81.43,15.2 81.43,8.47 82.53,8.47 82.53,15.2 83.62,15.2 83.62,8.47 84.58,8.47 84.58,15.2 85.55,15.2 85.55,8.47 86.51,8.47 86.51,15.2 87.48,15.2 87.48,8.47 88.42,8.47 88.42,15.2 89.36,15.2 89.36,8.47 90.3,8.47 90.3,15.2 91.24,15.2 91.24,8.47 92.18,8.47 92.18,15.2 93.12,15.2 93.12,8.47 94.06,8.47 94.06,15.2 95,15.2 95,8.47 95.96,8.47 95.96,15.2 96.93,15.2 96.93,8.47 97.89,8.47 97.89,15.2 98.86,15.2 98.86,8.47 99.72,8.47 99.72,15.2 100.58,15.2 100.58,8.47 101.45,8.47 101.45,15.2 102.29,15.2 102.29,8.47 103.12,8.47 103.12,15.2 103.96,15.2 103.96,8.47 104.8,8.47 104.8,15.2 105.64,15.2 105.64,8.47 106.48,8.47 106.48,15.2 107.31,15.2 107.31,8.47 108.15,8.47 108.15,15.2 108.99,15.2 108.99,8.47 109.83,8.47 109.83,15.2 110.67,15.2 110.67,8.47 111.51,8.47 111.51,15.2 112.37,15.2 112.37,8.47 113.23,8.47 113.23,15.2 114.1,15.2 114.1,8.47 114.86,8.47 114.86,15.2 115.62,15.2 115.62,8.47 116.38,8.47 116.38,15.2 117.14,15.2 117.14,8.47 117.91,8.47 117.91,15.2 118.67,15.2 118.67,8.47 119.43,8.47 119.43,15.2 120.19,15.2 120.19,8.47 120.95,8.47 120.95,15.2 121.72,15.2 121.72,8.47 122.48,8.47 122.48,15.2 123.24,15.2 123.24,8.47 124,8.47 124,15.2 124.77,15.2 124.77,8.47 125.53,8.47 125.53,15.2 126.29,15.2 126.29,8.47 127.05,8.47 127.05,15.2 127.81,15.2 127.81,8.47 128.57,8.47 128.57,15.2 129.34,15.2 129.34,8.46 130.23,8.46 130.23,15.24 131.01,15.24 131.01,8.46 131.78,8.46 131.78,16.43 131.19,16.43 131.19,25.3 130.12,25.3 130.12,31.22 130.94,31.22 130.94,26.11 132.03,26.11 132.03,17.25 132.82,17.25 132.82,26.9 131.75,26.9 131.75,32.41 131.19,32.41 131.19,41.35 130.23,41.35 130.23,46.61 131.39,47.78 133.96,47.78
GND
  Bottom 0.254: TH1.2 68.06,48.3 68.45,47.9 71.02,47.9 71.37,48.26 130.38,48.26 130.61,48.49 J1.4
  pour Bottom: -9.2,99.72 152.34,100.02 152.74,-6.95 -8.31,-8.95
TH1  (1 unrouted)
  Bottom 0.254: J1.3 69.9,48.99 TH1.1

### Text on the board
bNames: Miriam | Upper heater 007 | 20150918 Licensed under CERN OHL v.1.2